# EAGLE schematic zloshnikrev1 (EAGLE 6.1)
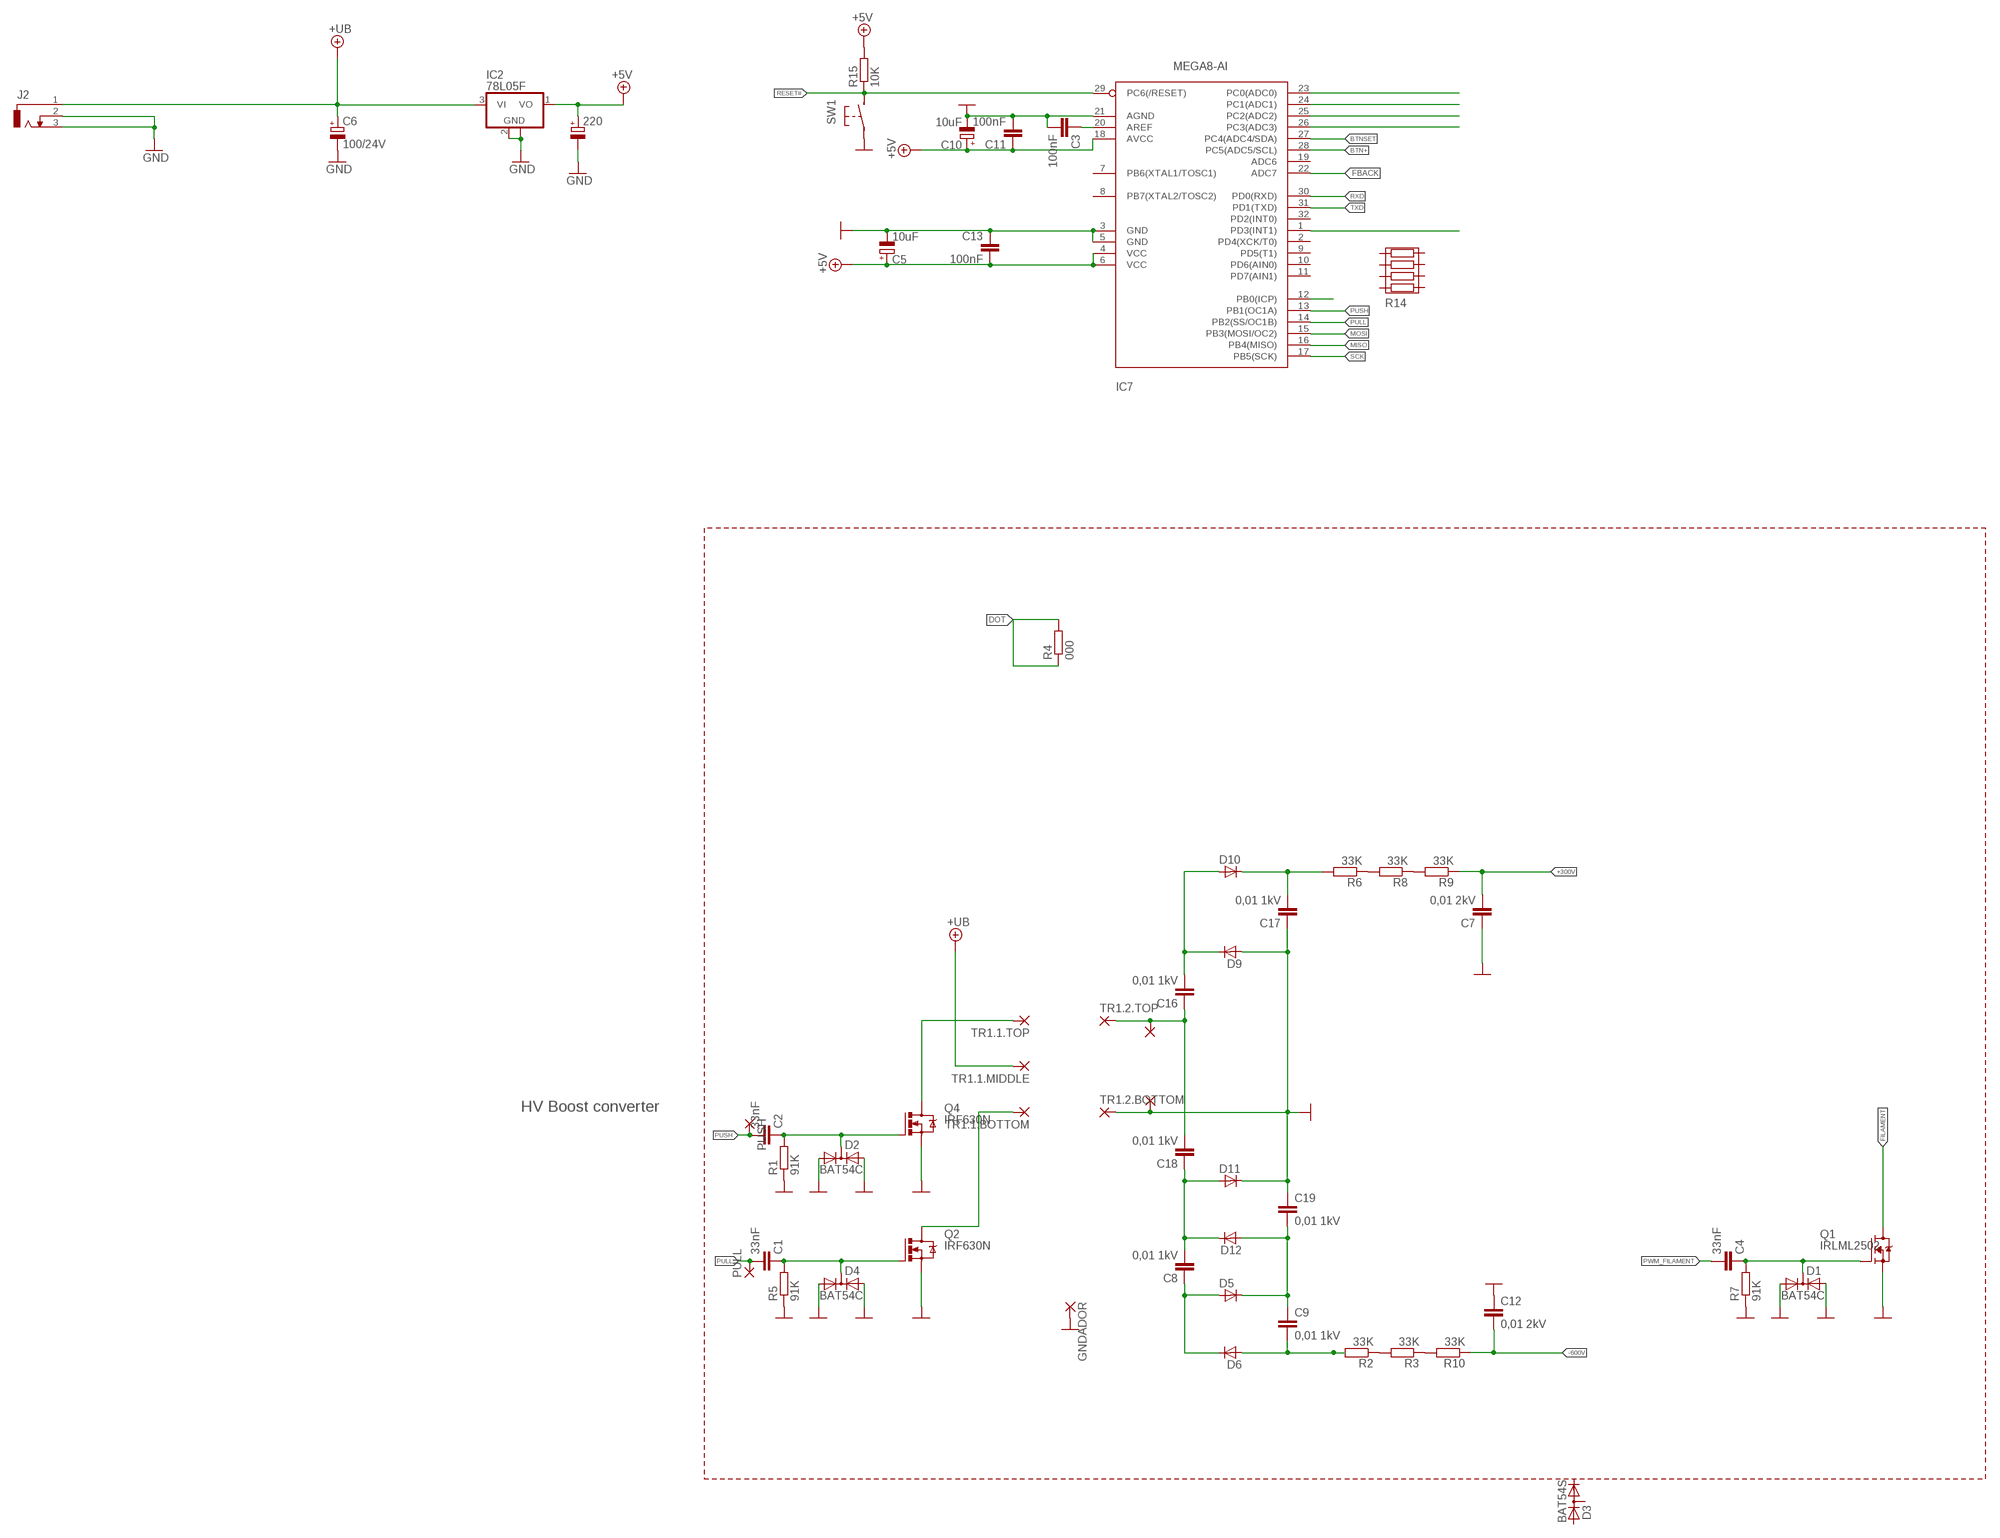
[diagram p0: schematic, sheet 1]

## Parts
220  CPOL-EUD/7343-31R  [D/7343-31R]
C1  33nF  C-EUC0805S  [C0805S]
C2  33nF  C-EUC0805S  [C0805S]
C3  100nF  C-EUC0603K  [C0603K]
C4  33nF  C-EUC0805S  [C0805S]
C5  10uF  CPOL-EUSMCB  [SMC_B]
C6  100/24V  CPOL-EUE3.5-8  [E3,5-8]
C7  0,01 2kV  C-EUC1812  [C1812]
C8  0,01 1kV  C-EUC2220K  [C2220K]
C9  0,01 1kV  C-EUC2220K  [C2220K]
C10  10uF  CPOL-EUSMCB  [SMC_B]
C11  100nF  C-EUC0603K  [C0603K]
C12  0,01 2kV  C-EUC1812  [C1812]
C13  100nF  C-EUC0603K  [C0603K]
C16  0,01 1kV  C-EUC2220K  [C2220K]
C17  0,01 1kV  C-EUC2220K  [C2220K]
C18  0,01 1kV  C-EUC2220K  [C2220K]
C19  0,01 1kV  C-EUC2220K  [C2220K]
D1  BAT54C  DIODE-2AC|CASOT23  [SOT23]
D2  BAT54C  DIODE-2AC|CASOT23  [SOT23]
D3  BAT54S  DIODE_2CACA-SOT23  [SOT23@1]
D4  BAT54C  DIODE-2AC|CASOT23  [SOT23]
D5  D-SOD-87  [SOD87]
D6  D-SOD-87  [SOD87]
D9  D-SOD-87  [SOD87]
D10  D-SOD-87  [SOD87]
D11  D-SOD-87  [SOD87]
D12  D-SOD-87  [SOD87]
GNDADOR  1,6/0,8  [1,6/0,8]
IC2  78L05F  [SOT89]
IC7  MEGA8-AI  [TQFP32-08]
J2  DCJ-SMALL  [DCJ-SMALL]
PULL  1,6/0,8  [1,6/0,8]
PUSH  1,6/0,8  [1,6/0,8]
Q1  IRLML2502  [SOT23-3]
Q2  IRF630N  IRF740  [TO220BV]
Q4  IRF630N  IRF740  [TO220BV]
R1  91K  R-EU_R0805S  [R0805-SVO]
R2  33K  R-EU_R0805S  [R0805-SVO]
R3  33K  R-EU_R0805S  [R0805-SVO]
R4  000  R-EU_R0805S  [R0805-SVO]
R5  91K  R-EU_R0805S  [R0805-SVO]
R6  33K  R-EU_R0805S  [R0805-SVO]
R7  91K  R-EU_R0805S  [R0805-SVO]
R8  33K  R-EU_R0805S  [R0805-SVO]
R9  33K  R-EU_R0805S  [R0805-SVO]
R10  33K  R-EU_R0805S  [R0805-SVO]
R14  RES4  [RESSMD-YC16]
R15  10K  R-EU_R0805S  [R0805-SVO]
SW1  BUTTON-IT_1181  [SW_IT1181]
TR1.1.BOTTOM  1,6/0,8  [1,6/0,8]
TR1.1.MIDDLE  1,6/0,8  [1,6/0,8]
TR1.1.TOP  1,6/0,8  [1,6/0,8]
TR1.2.BOTTOM  1,6/0,8  [1,6/0,8]
TR1.2.BOTTOM1  1,6/0,8  [1,6/0,8]
TR1.2.TOP  1,6/0,8  [1,6/0,8]
TR1.2.TOP1  1,6/0,8  [1,6/0,8]

## Nets
+5V: 220.+ C5.+ C10.+ C11.1 C13.2 IC2.1(VO) IC7.4(VCC) IC7.6(VCC) IC7.18(AVCC) R15.2
+300V: C7.2 R9.1
+UB: C6.+ IC2.3(VI) J2.1 TR1.1.MIDDLE.1(P)
-600V: C12.2 R10.1
BTN+: IC7.28(PC5(ADC5/SCL))
BTNSET: IC7.27(PC4(ADC4/SDA))
D0: IC7.26(PC3(ADC3))
D1: IC7.24(PC1(ADC1))
D2: IC7.23(PC0(ADC0))
D3: IC7.25(PC2(ADC2))
DOT: IC7.1(PD3(INT1)) R4.1 R4.2
FBACK: IC7.22(ADC7)
FILAMENT: Q1.3(D)
GND: 220.- C3.2 C5.- C6.- C7.1 C10.- C11.2 C12.1 C13.1 C17.1 C19.1 D1.1(A1) D1.2(A2) D2.1(A1) D2.2(A2) D4.1(A1) D4.2(A2) D9.2(A) D11.1(C) GNDADOR.1(P) IC2.2(GND) IC2.2@1(GND) IC7.3(GND) IC7.5(GND) IC7.21(AGND) J2.2 J2.3 Q1.2(S) Q2.S Q4.S R1.1 R5.1 R7.1 SW1.P$1(P1) TR1.2.BOTTOM1.1(P) TR1.2.BOTTOM.1(P)
MISO: IC7.16(PB4(MISO))
MOSI: IC7.15(PB3(MOSI/OC2))
N$1: C1.1 D4.3(C) Q2.G R5.2
N$2: Q4.D TR1.1.TOP.1(P)
N$3: C2.1 D2.3(C) Q4.G R1.2
N$4: Q2.D TR1.1.BOTTOM.1(P)
N$5: C3.1 IC7.20(AREF)
N$6: C16.2 D9.1(C) D10.2(A)
N$7: C8.2 C18.1 D11.2(A) D12.1(C)
N$9: R8.1 R9.2
N$10: C4.1 D1.3(C) Q1.1(G) R7.2
N$11: R6.1 R8.2
N$12: R2.1 R3.2
N$13: C17.2 D10.1(C) R6.2
N$14: C8.1 D5.2(A) D6.1(C)
N$15: C9.2 D6.2(A) R2.2
N$16: C16.1 C18.2 TR1.2.TOP1.1(P) TR1.2.TOP.1(P)
N$17: C9.1 C19.2 D5.1(C) D12.2(A)
N$18: R3.1 R10.2
N$35: IC7.12(PB0(ICP))
PULL: C1.2 IC7.14(PB2(SS/OC1B)) PULL.1(P)
PUSH: C2.2 IC7.13(PB1(OC1A)) PUSH.1(P)
PWM_FILAMENT: C4.2
RESET#: IC7.29(PC6(/RESET)) R15.1 SW1.P$2(P2)
RXD: IC7.30(PD0(RXD))
SCK: IC7.17(PB5(SCK))
TXD: IC7.31(PD1(TXD))
Unconnected: D3.1(A) D3.2(C) D3.3(AC) IC7.2(PD4(XCK/T0)) IC7.7(PB6(XTAL1/TOSC1)) IC7.8(PB7(XTAL2/TOSC2)) IC7.9(PD5(T1)) IC7.10(PD6(AIN0)) IC7.11(PD7(AIN1)) IC7.19(ADC6) IC7.32(PD2(INT0)) R14.R1$1(1.1) R14.R1$2(1.2) R14.R2$1(2.1) R14.R2$2(2.2) R14.R3$1(3.1) R14.R3$2(3.2) R14.R4$1(4.1) R14.R4$2(4.2)

## Notes on the sheet
- HV Boost converter

## Library data of the parts
220 C5 C6 C10 = rcl:CPOL-EU: POLARIZED CAPACITOR, European symbol
C1-C4 C11 C13 = rcl:C-EU: CAPACITOR, European symbol
C7-C9 C12 C16-C19 = 0-rcl:C-EU: CAPACITOR, European symbol
D1 D2 D4 = diode:DIODE-2AC|CA: Dual DIODE Anode-Cathode|Cathode-Anode
D3 = diode:DIODE_2CACA-: 2 Diodes - Cathode-Anode|Cathode-Anode
D5 D6 D9-D12 = semicon-smd-ipc:D-: DIODE unfilled
GNDADOR PULL PUSH TR1.1.BOTTOM TR1.1.MIDDLE TR1.1.TOP TR1.2.BOTTOM TR1.2.BOTTOM1 TR1.2.TOP TR1.2.TOP1 = wirepad:1,6/0,8: THROUGH-HOLE PAD
IC2 = linear:78L*: POSITOIV-VOLTAGE REGULATORS Output up to 100 mA Source: http://focus.ti.com/lit/ds/symlink/ua78l05.pdf
IC7 = atmel:MEGA8: MICROCONTROLLER 8 Kbytes FLASH, 1 kbytes SRAM, 512 bytes EEPROM, USART, 6-channel 10 bit ADC, 2-channel 8 bit ADC Pin compatible with Atmega48, ATMega88, ATMega168 Source: avr.lbr
J2 = 0-svo:DCJ-SMALL: Smaller DC power jack
Q1 = xmaker:IRLML2502: International Rectifier N-MOSFET.
Q2 Q4 = transistor-power:IRF740: N-CHANNEL MOS FET
R1-R10 R15 = rcl:R-EU_: RESISTOR, European symbol
R14 = 0-svo:RES4
SW1 = 0-svo:BUTTON-IT_1181